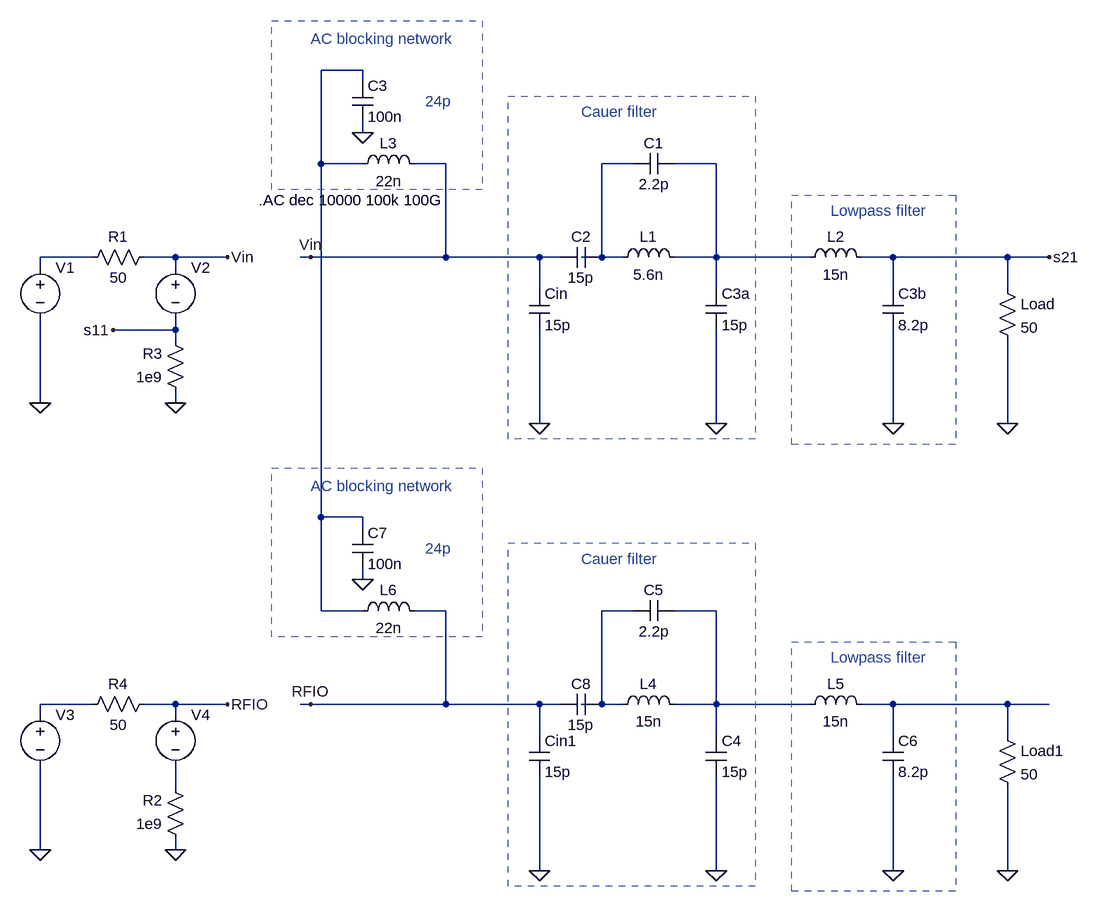
[diagram p0: schematic DualOutPutFilter.asc]
DualOutPutFilter.asc, the LTspice schematic file:
Version 4
SHEET 1 2444 680
WIRE -464 -784 -528 -784
WIRE -464 -768 -464 -784
WIRE -464 -688 -464 -704
WIRE -528 -640 -528 -784
WIRE -464 -640 -528 -640
WIRE -336 -640 -384 -640
WIRE -48 -640 -96 -640
WIRE 80 -640 16 -640
WIRE -880 -496 -960 -496
WIRE -752 -496 -800 -496
WIRE -672 -496 -752 -496
WIRE -544 -496 -560 -496
WIRE -336 -496 -336 -640
WIRE -336 -496 -544 -496
WIRE -192 -496 -336 -496
WIRE -160 -496 -192 -496
WIRE -96 -496 -96 -640
WIRE -96 -496 -128 -496
WIRE -64 -496 -96 -496
WIRE 80 -496 80 -640
WIRE 80 -496 16 -496
WIRE 224 -496 80 -496
WIRE 352 -496 304 -496
WIRE 528 -496 352 -496
WIRE 592 -496 528 -496
WIRE -960 -480 -960 -496
WIRE -752 -480 -752 -496
WIRE -192 -448 -192 -496
WIRE 80 -448 80 -496
WIRE 352 -448 352 -496
WIRE 528 -448 528 -496
WIRE -752 -384 -752 -400
WIRE -752 -384 -848 -384
WIRE -752 -368 -752 -384
WIRE -960 -272 -960 -400
WIRE -752 -272 -752 -288
WIRE -192 -240 -192 -384
WIRE 80 -240 80 -384
WIRE 352 -240 352 -384
WIRE 528 -240 528 -368
WIRE -528 -96 -528 -640
WIRE -464 -96 -528 -96
WIRE -464 -80 -464 -96
WIRE -464 0 -464 -16
WIRE -528 48 -528 -96
WIRE -464 48 -528 48
WIRE -336 48 -384 48
WIRE -48 48 -96 48
WIRE 80 48 16 48
WIRE -880 192 -960 192
WIRE -752 192 -800 192
WIRE -672 192 -752 192
WIRE -544 192 -560 192
WIRE -336 192 -336 48
WIRE -336 192 -544 192
WIRE -192 192 -336 192
WIRE -160 192 -192 192
WIRE -96 192 -96 48
WIRE -96 192 -128 192
WIRE -64 192 -96 192
WIRE 80 192 80 48
WIRE 80 192 16 192
WIRE 224 192 80 192
WIRE 352 192 304 192
WIRE 528 192 352 192
WIRE 592 192 528 192
WIRE -960 208 -960 192
WIRE -752 208 -752 192
WIRE -192 240 -192 192
WIRE 80 240 80 192
WIRE 352 240 352 192
WIRE 528 240 528 192
WIRE -752 320 -752 288
WIRE -960 416 -960 288
WIRE -752 416 -752 400
WIRE -192 448 -192 304
WIRE 80 448 80 304
WIRE 352 448 352 304
WIRE 528 448 528 320
FLAG 80 -240 0
FLAG 528 -240 0
FLAG -960 -272 0
FLAG 352 -240 0
FLAG -192 -240 0
FLAG -672 -496 Vin
FLAG -544 -496 Vin
FLAG -464 -688 0
FLAG -752 -272 0
FLAG -848 -384 s11
FLAG 592 -496 s21
FLAG 80 448 0
FLAG 528 448 0
FLAG 352 448 0
FLAG -192 448 0
FLAG -544 192 RFIO
FLAG -464 0 0
FLAG -960 416 0
FLAG -672 192 RFIO
FLAG -752 416 0
SYMBOL cap 64 -448 R0
SYMATTR InstName C3a
SYMATTR Value 15p
SYMBOL cap -48 -624 R270
WINDOW 0 32 32 VTop 2
WINDOW 3 0 32 VBottom 2
SYMATTR InstName C1
SYMATTR Value 2.2p
SYMBOL res 512 -464 R0
SYMATTR InstName Load
SYMATTR Value 50
SYMBOL res -736 -272 R180
WINDOW 0 36 76 Left 2
WINDOW 3 36 40 Left 2
SYMATTR InstName R3
SYMATTR Value 1e9
SYMBOL ind -80 -480 R270
WINDOW 0 32 56 VTop 2
WINDOW 3 5 56 VBottom 2
SYMATTR InstName L1
SYMATTR Value 5.6n
SYMBOL cap 336 -448 R0
SYMATTR InstName C3b
SYMATTR Value 8.2p
SYMBOL cap -208 -448 R0
SYMATTR InstName Cin
SYMATTR Value 15p
SYMBOL ind 208 -480 R270
WINDOW 0 32 56 VTop 2
WINDOW 3 5 56 VBottom 2
SYMATTR InstName L2
SYMATTR Value 15n
SYMBOL cap -480 -768 R0
SYMATTR InstName C3
SYMATTR Value 100n
SYMBOL ind -480 -624 R270
WINDOW 0 32 56 VTop 2
WINDOW 3 5 56 VBottom 2
SYMATTR InstName L3
SYMATTR Value 22n
SYMBOL res -896 -480 R270
WINDOW 0 32 56 VTop 2
WINDOW 3 0 56 VBottom 2
SYMATTR InstName R1
SYMATTR Value 50
SYMBOL voltage -960 -496 R0
SYMATTR InstName V1
SYMATTR Value ""
SYMATTR Value2 AC 2
SYMBOL voltage -752 -496 R0
SYMATTR InstName V2
SYMATTR Value ""
SYMATTR Value2 AC 1
SYMBOL cap -160 -480 R270
WINDOW 0 32 32 VTop 2
WINDOW 3 0 32 VBottom 2
SYMATTR InstName C2
SYMATTR Value 15p
SYMBOL cap 64 240 R0
SYMATTR InstName C4
SYMATTR Value 15p
SYMBOL cap -48 64 R270
WINDOW 0 32 32 VTop 2
WINDOW 3 0 32 VBottom 2
SYMATTR InstName C5
SYMATTR Value 2.2p
SYMBOL res 512 224 R0
SYMATTR InstName Load1
SYMATTR Value 50
SYMBOL ind -80 208 R270
WINDOW 0 32 56 VTop 2
WINDOW 3 5 56 VBottom 2
SYMATTR InstName L4
SYMATTR Value 15n
SYMBOL cap 336 240 R0
SYMATTR InstName C6
SYMATTR Value 8.2p
SYMBOL cap -208 240 R0
SYMATTR InstName Cin1
SYMATTR Value 15p
SYMBOL ind 208 208 R270
WINDOW 0 32 56 VTop 2
WINDOW 3 5 56 VBottom 2
SYMATTR InstName L5
SYMATTR Value 15n
SYMBOL cap -480 -80 R0
SYMATTR InstName C7
SYMATTR Value 100n
SYMBOL ind -480 64 R270
WINDOW 0 32 56 VTop 2
WINDOW 3 5 56 VBottom 2
SYMATTR InstName L6
SYMATTR Value 22n
SYMBOL cap -160 208 R270
WINDOW 0 32 32 VTop 2
WINDOW 3 0 32 VBottom 2
SYMATTR InstName C8
SYMATTR Value 15p
SYMBOL res -736 416 R180
WINDOW 0 36 76 Left 2
WINDOW 3 36 40 Left 2
SYMATTR InstName R2
SYMATTR Value 1e9
SYMBOL res -896 208 R270
WINDOW 0 32 56 VTop 2
WINDOW 3 0 56 VBottom 2
SYMATTR InstName R4
SYMATTR Value 50
SYMBOL voltage -960 192 R0
SYMATTR InstName V3
SYMATTR Value ""
SYMATTR Value2 AC 2
SYMBOL voltage -752 192 R0
SYMATTR InstName V4
SYMATTR Value ""
SYMATTR Value2 AC 1
TEXT -624 -584 Left 2 !.AC dec 10000 100k 100G
TEXT -368 -736 Left 2 ;24p
TEXT -128 -720 Left 2 ;Cauer filter
TEXT -544 -832 Left 2 ;AC blocking network
TEXT 256 -568 Left 2 ;Lowpass filter
TEXT -368 -48 Left 2 ;24p
TEXT -128 -32 Left 2 ;Cauer filter
TEXT -544 -144 Left 2 ;AC blocking network
TEXT 256 120 Left 2 ;Lowpass filter
RECTANGLE Normal 196 -592 448 -208 2
RECTANGLE Normal -604 -860 -280 -600 2
RECTANGLE Normal -240 -744 140 -216 2
RECTANGLE Normal 196 96 448 480 2
RECTANGLE Normal -604 -172 -280 88 2
RECTANGLE Normal -240 -56 140 472 2

The netlist it stands for:
* DualOutPutFilter.asc
C3a N003 0 15p
C1 N002 N003 2.2p
R§Load s21 0 50
R3 0 s11 1e9
L1 N002 N003 5.6n
C3b s21 0 8.2p
Cin Vin 0 15p
L2 N003 s21 15n
C3 N001 0 100n
L3 N001 Vin 22n
R1 N004 Vin 50
V1 N004 0 AC 2
V2 Vin s11 AC 1
C2 Vin N002 15p
C4 N006 0 15p
C5 N005 N006 2.2p
R§Load1 N008 0 50
L4 N005 N006 15n
C6 N008 0 8.2p
Cin1 RFIO 0 15p
L5 N006 N008 15n
C7 N001 0 100n
L6 N001 RFIO 22n
C8 RFIO N005 15p
R2 0 N009 1e9
R4 N007 RFIO 50
V3 N007 0 AC 2
V4 RFIO N009 AC 1
.AC dec 10000 100k 100G
* 24p
* Cauer filter
* AC blocking network
* Lowpass filter
* 24p
* Cauer filter
* AC blocking network
* Lowpass filter
.backanno
.end